# EAGLE design PWM Buck V1 (EAGLE 7.3.0)
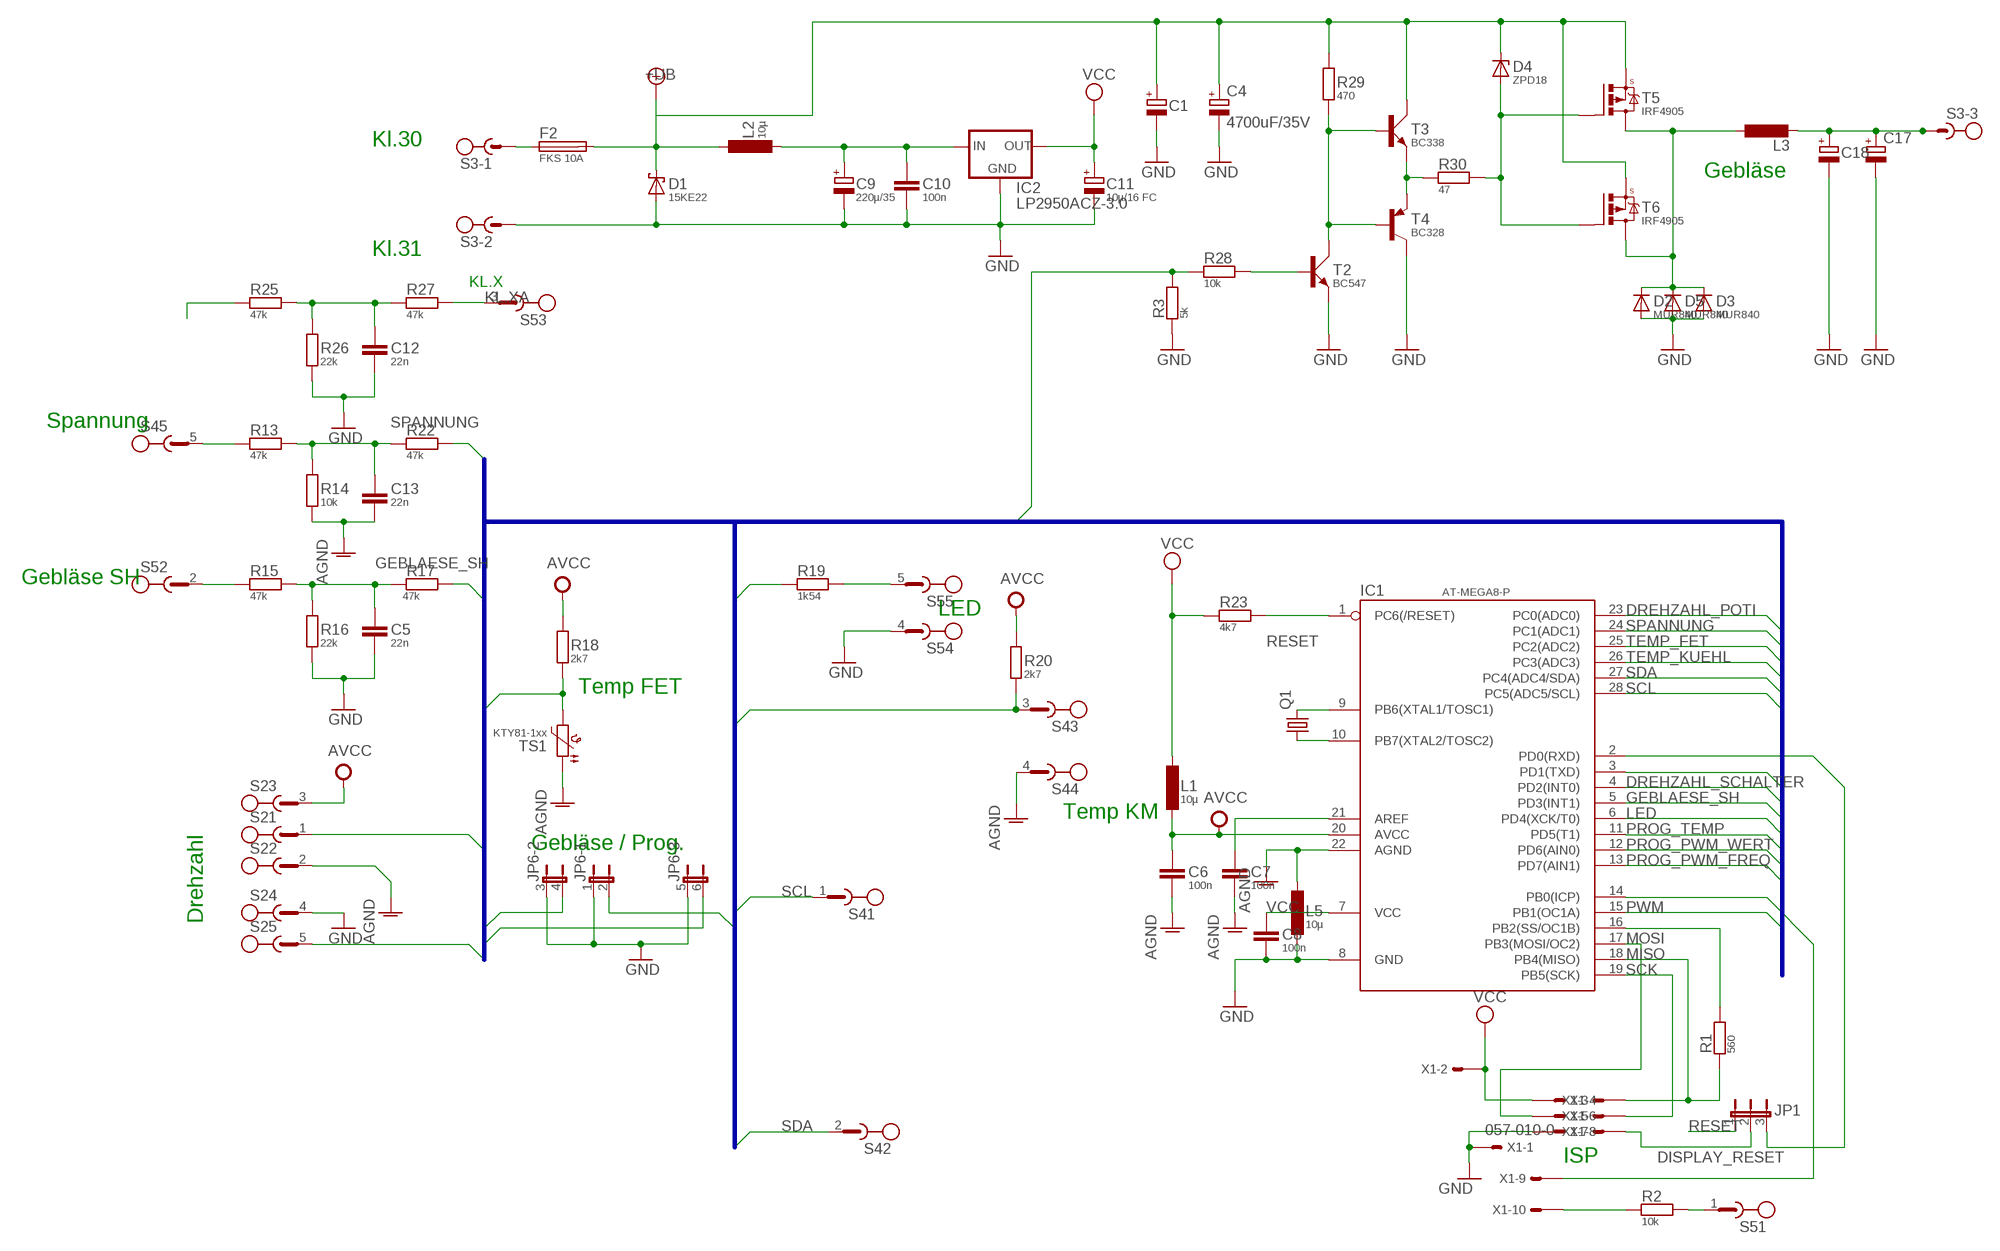
[diagram p0: schematic, sheet 1]

## Parts
C1  C_POL_5-10.5  [E5-10.5]
C4  4700uF/35V  CPOL-EUE7.5-18  [E7,5-18]
C5  22n  C_75_SCHMAL  [C_75_SCHMAL]
C6  100n  C_50_SCHMAL  [C_50_SCHMAL]
C7  100n  C_50_SCHMAL  [C_50_SCHMAL]
C8  100n  C_50_SCHMAL  [C_50_SCHMAL]
C9  220µ/35  C_POL_5-10.5  [E5-10.5]
C10  100n  C_75_SCHMAL  [C_75_SCHMAL]
C11  10µ/16 FC  C_POL_2.5-5  [E2.5-5]
C12  22n  C_75_SCHMAL  [C_75_SCHMAL]
C13  22n  C_75_SCHMAL  [C_75_SCHMAL]
C17  CPOL-EUE5-13  [E5-13]
C18  C_POL_5-10.5  [E5-10.5]
D1  15KE22  15KEXXD  [DO201T15]
D2  MUR840  [TO220ACS]
D3  MUR840  [TO220ACS]
D4  ZPD18  ZPD  [DO35Z10]
D5  MUR840  [TO220ACS]
F2  FKS 10A  FKS  [FKS]
IC1  AT-MEGA8-P  [AT-MEGA8P]
IC2  LP2950ACZ-3.0  [TO92]
JP1  JP2E  [JP2]
JP6  JP3QE  [JP3Q]
L1  10µ  L-2200-12,7  [L-2200-12,7]
L2  10µ  L-2200-12,7  [L-2200-12,7]
L3  L-EU0207/12  [0207/12]
L5  10µ  L-2200-12,7  [L-2200-12,7]
Q1  CRYSTALTC26V  [TC26V]
R1  560  R_10  [R_10]
R2  10k  R_10  [R_10]
R3  5k  R_10  [R_10]
R13  47k  R_10  [R_10]
R14  10k  R_10  [R_10]
R15  47k  R_10  [R_10]
R16  22k  R_10  [R_10]
R17  47k  R_10  [R_10]
R18  2k7  R_10  [R_10]
R19  1k54  R_10  [R_10]
R20  2k7  R_12  [R_12]
R22  47k  R_10  [R_10]
R23  4k7  R_10  [R_10]
R25  47k  R_10  [R_10]
R26  22k  R_10  [R_10]
R27  47k  R_10  [R_10]
R28  10k  R_10  [R_10]
R29  470  R_10  [R_10]
R30  47  R_10  [R_10]
S2  CON-PLATINE_5-POLIG  [CON-PLATINE_5-POLIG]
S3  CON-RIA-220-03  [RIA-220-03]
S4  CON-RIA-183-05  [RIA-183-05]
S5  CON-RIA-183-05  [RIA-183-05]
T2  BC547  BC547-WIDE  [SOT54A-WIDE]
T3  BC338  BC547-WIDE  [SOT54A-WIDE]
T4  BC328  BC557-WIDE  [TO92_WIDE]
T5  IRF4905  MOSFET-P-IRF4905  [TO220BV]
T6  IRF4905  MOSFET-P-IRF4905  [TO220BV]
TS1  KTY81-1xx  PTC-SOD70  [SOD70]
X1  057-010-0  [057-010-0]

## Nets
+UB: C1.+ C4.+ D1.C D4.C F2.2 L2.2 R29.2 T3.C T5.S T6.S
AGND: C6.2 C7.2 C13.1 IC1.22(AGND) L5.2 R14.1 S2.2 S4.4 TS1.1
AVCC: C6.1 IC1.20(AVCC) L1.1 R18.2 R20.2 S2.3
BEL_K58B: R2.2 X1.10
BEL_SH: IC1.14(PB0(ICP)) X1.9
DISPLAY_RESET: JP1.2 X1.7
DREHZAHL_POTI: IC1.23(PC0(ADC0)) S2.1
DREHZAHL_SCHALTER: IC1.4(PD2(INT0)) S2.5
GATE: D4.A R30.1 T5.G T6.G
GEBLAESE_OUT: D2.C D3.C D5.C L3.1 T5.D T6.D
GEBLAESE_SH: IC1.5(PD3(INT1)) R17.1
GND: C1.- C4.- C5.1 C8.2 C9.- C10.2 C11.- C12.1 C17.- C18.- D1.A D2.A D3.A D5.A IC1.8(GND) IC2.2(GND) JP6.1 JP6.3 JP6.5 L5.1 R3.2 R16.1 R26.1 S2.4 S3.2 S5.4 T2.E T4.3(C) X1.1 X1.8
KL.X: IC1.3(PD1(TXD)) R25.1
KL.XA: R27.1 S5.3
LED: IC1.6(PD4(XCK/T0)) R19.2
MISO: IC1.18(PB4(MISO)) R1.1 X1.3
MOSI: IC1.17(PB3(MOSI/OC2)) X1.6
N$1: IC1.9(PB6(XTAL1/TOSC1)) Q1.2
N$2: IC1.10(PB7(XTAL2/TOSC2)) Q1.1
N$3: IC1.16(PB2(SS/OC1B)) R1.2
N$5: F2.1 S3.1
N$6: IC1.2(PD0(RXD)) JP1.3
N$7: C5.2 R15.2 R16.2 R17.2
N$8: C9.+ C10.1 IC2.3(IN) L2.1
N$9: R29.1 T2.C T3.B T4.2(B)
N$11: R2.1 S5.1
N$15: C17.+ C18.+ L3.2 S3.3
N$21: C7.1 IC1.21(AREF)
N$30: R28.1 T2.B
N$31: R30.2 T3.E T4.1(E)
N$33: C12.2 R25.2 R26.2 R27.2
N$36: R19.1 S5.5
NIX: C13.2 R13.2 R14.2 R22.1
PROG_PWM_FREQ: IC1.13(PD7(AIN1)) JP6.6
PROG_PWM_WERT: IC1.12(PD6(AIN0)) JP6.4
PROG_TEMP: IC1.11(PD5(T1)) JP6.2
PWM: IC1.15(PB1(OC1A)) R3.1 R28.2
RESET: IC1.1(PC6(/RESET)) JP1.1 R23.2
SCK: IC1.19(PB5(SCK)) X1.5
SCL: IC1.28(PC5(ADC5/SCL)) S4.1
SDA: IC1.27(PC4(ADC4/SDA)) S4.2
SH: R15.1 S5.2
SPANNUNG: IC1.24(PC1(ADC1)) R22.2
SPG: R13.1 S4.5
TEMP_FET: IC1.25(PC2(ADC2)) R18.1 TS1.2
TEMP_KUEHL: IC1.26(PC3(ADC3)) R20.1 S4.3
VCC: C8.1 C11.+ IC1.7(VCC) IC2.1(OUT) L1.2 R23.1 X1.2 X1.4

## Buses
BUS:STUFE1,STUFE2,STUFE3,A0,CLIMATRONIC,DREHZAHL_POTI,DREHZAHL_SCHALTER,JUMPER_CLIMA,JUMPER_MANUELL,TEMP_FET,TEMP_KUEHL,LED,RELAIS,SPANNUNG,GEBLAESE_SH,INTERFACE1,INTERFACE2,PWM,KL.X,PROG_PWM_FREQ,PROG_TEMP,PROG_PWM_WERT

## Notes on the sheet
- Kl.30
- Gebläse
- Kl.31
- KL.X
- Spannung
- Gebläse SH
- LED
- Temp FET
- Temp KM
- Drehzahl
- Gebläse / Prog.
- ISP

## Library data of the parts
C1 C9 C18 = 0_Eigene:C_POL_5-10.5
C4 C17 = rcl:CPOL-EU: POLARIZED CAPACITOR, European symbol
C5 C10 C12 C13 = 0_Eigene:C_75_SCHMAL
C6-C8 = 0_Eigene:C_50_SCHMAL
C11 = 0_Eigene:C_POL_2.5-5
D1 = 0_Eigene:15KEXXD: DIODE
D2 D3 D5 = 0_Eigene:MUR840: DIODE
D4 = 0_Eigene:ZPD: Z DIODE 500 mW
F2 = 0_Eigene:FKS: Sicherungshalter für KFZ-Flachsicherung
IC1 = 0_Eigene:AT-MEGA8-P
IC2 = v-reg:LP2950?*: Source: http://cache.national.com/ds/LP/LP2950.pdf
JP1 = 0_Eigene:JP2E: JUMPER
JP6 = jumper:JP3QE: JUMPER
L1 L2 L5 = 0_Eigene:L-2200-12,7
L3 = rcl:L-EU: INDUCTOR, European symbol
Q1 = crystal:CRYSTAL: CRYSTAL
R1-R3 R13-R19 R22 R23 R25-R30 = 0_Eigene:R_10
R20 = 0_Eigene:R_12
S2 = 0_Eigene:CON-PLATINE_5-POLIG
S3 = 0_Eigene:CON-RIA-220-03
S4 S5 = 0_Eigene:CON-RIA-183-05
T2 T3 = 0_Eigene:BC547-WIDE
T4 = 0_Eigene:BC557-WIDE
T5 T6 = 0_Eigene:MOSFET-P-IRF4905: P-CHANNEL HEXFET POWER-MOS-FET Source: http://www.irf.com/product-info/datasheets/data/irf9530.pdf
TS1 = 0_Eigene:PTC-: Positive Temperature Coefficient Resistor (PTC) termistor Philips KTY81-210 - KTY81-252 Source: 153627-da-01-en-Temperatur-Sensor_KTY10-6_Philips.pdf
X1 = con-panduit:057-010-: CONNECTOR 10-pin series 057 contact pc board low profile headers

## Board
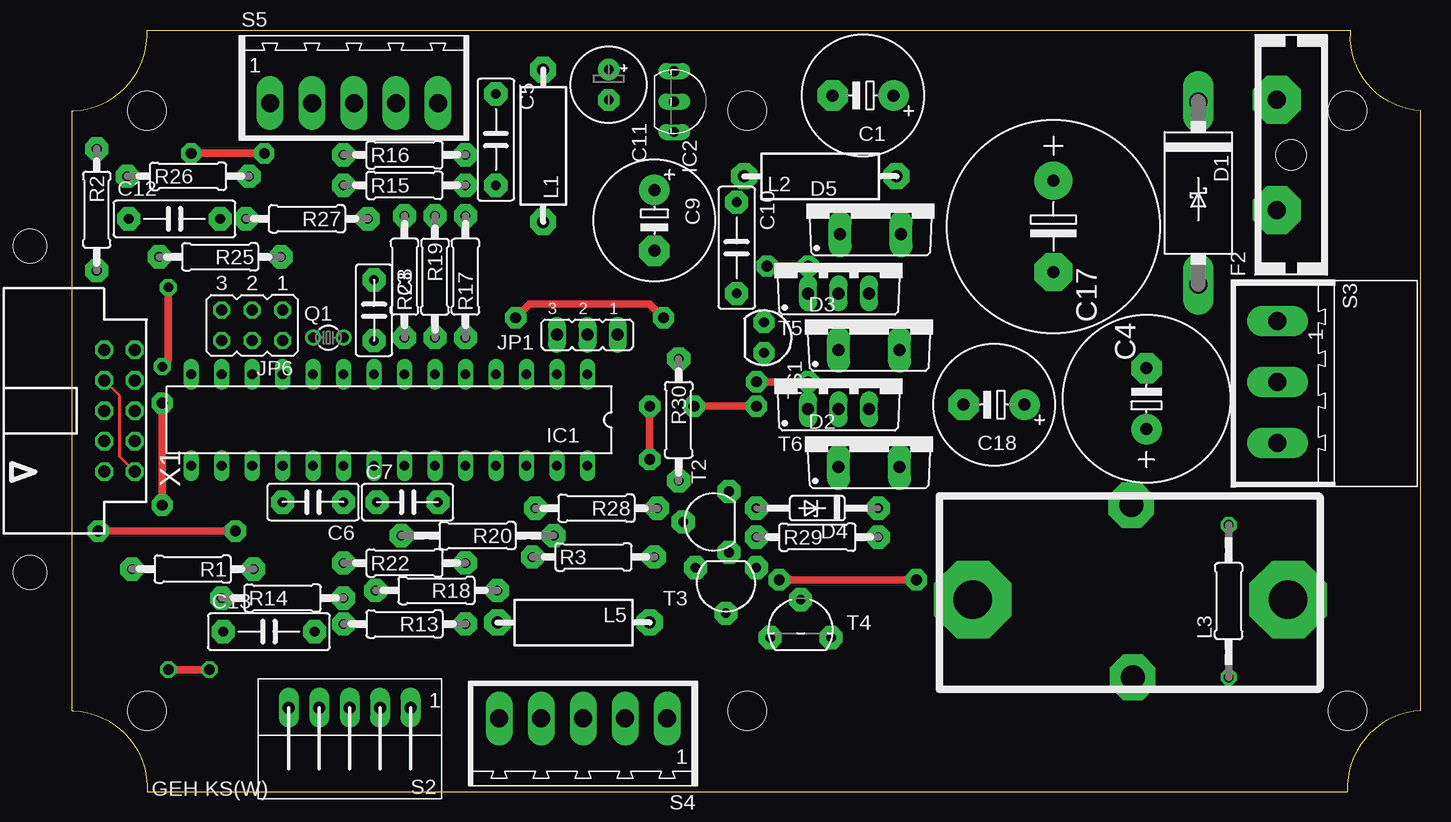
[diagram p1: board, top side]
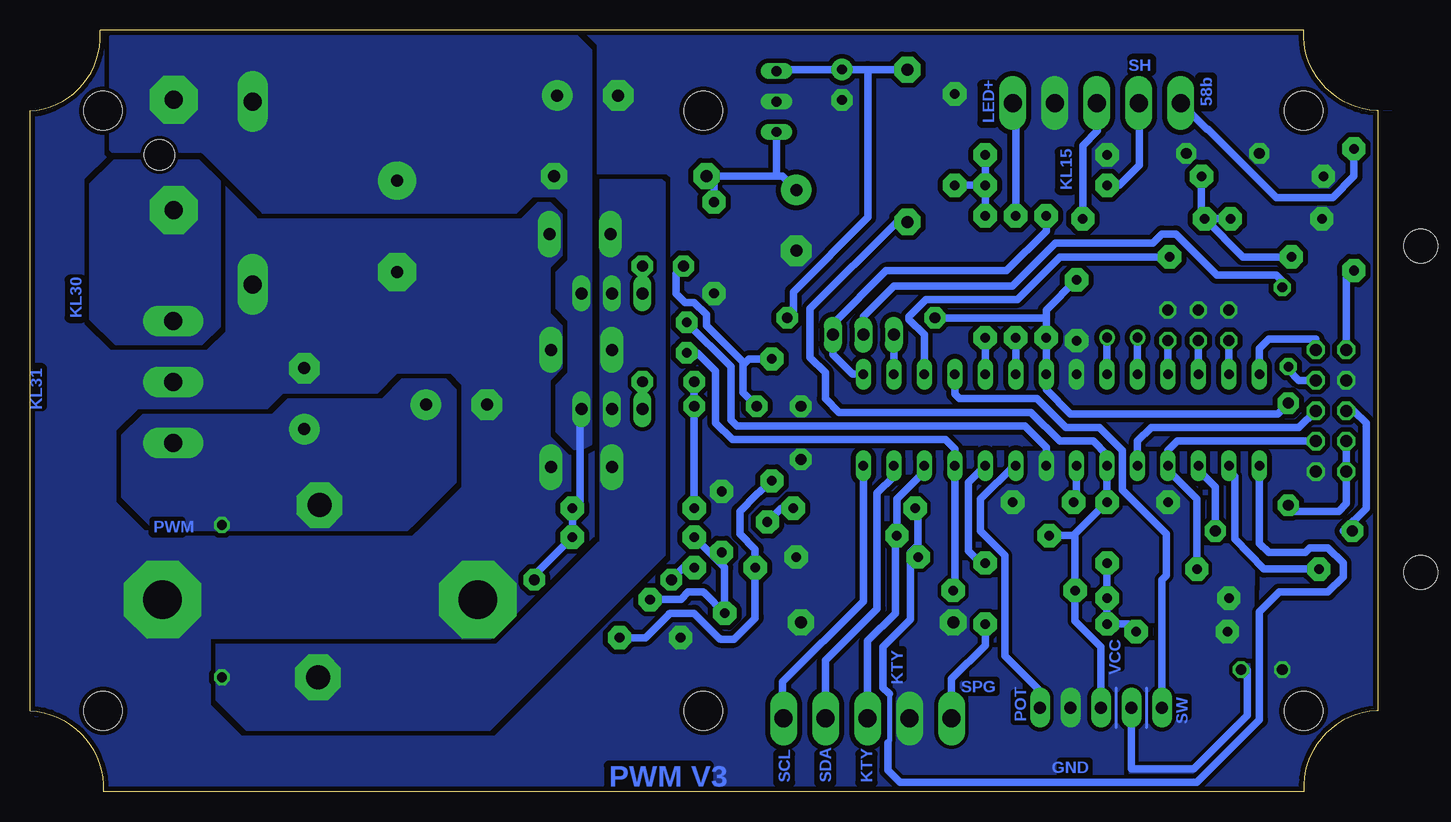
[diagram p2: board, bottom side, seen from below]

Size 112.39 x 63.5 mm. Coordinates in mm from the lower left corner, seen from the top.
Copper layers (1*16): Top 0.035mm / dielectric 1.5mm / Bottom 0.035mm
Design rules "default *": minimum track width 8mil, minimum drill 24mil, track to track 8mil, track to pad 8mil, pad to pad 8mil, via to via 8mil, smd to smd 8mil, copper to edge 12mil, drill to drill 8mil, minimum pad ring 10mil, minimum via ring 8mil, stop-mask expansion 4mil, vias tented up to drill 0mil, thermal gap 10mil

### Footprints (pad centres in the part's own frame; a part is rotated, then mirrored left to right if it is on the bottom)
E5-10.5 = drill 1 pad 2.54: + -2.54,0 | drill 1 pad 2.54 octagon: - 2.54,0
E7,5-18 = drill 1.016 pad 3.15: + -3.81,0 | drill 1.016 pad 3.15 octagon: - 3.81,0
C_75_SCHMAL = drill 0.8 pad 1.93 octagon: 1 -3.81,0; 2 3.81,0
C_50_SCHMAL = drill 0.8 pad 1.93 octagon: 1 -2.54,0; 2 2.54,0
E2.5-5 = drill 0.8 pad 1.778: + -1.27,0 | drill 0.8 pad 1.778 octagon: - 1.27,0
E5-13 = drill 1.016 pad 2.54: + -2.54,0 | drill 1.016 pad 2.54 octagon: - 2.54,0
DO201T15 = drill 1.5 pad 2.54 long: A 7.62,0; C -7.62,0
TO220ACS = drill 1 pad 1.93 long: A 2.54,-2.54; C -2.54,-2.54
DO35Z10 = drill 0.8 pad 1.93 octagon: A 5.08,0; C -5.08,0
FKS = drill 1.5 pad 4 octagon: 1 -4.6,1.2; 2 4.6,1.2 | hole 2.5: 0,0
AT-MEGA8P = drill 0.8 long: 1 -16.51,-3.81; 2 -13.97,-3.81; 3 -11.43,-3.81; 4 -8.89,-3.81; 5 -6.35,-3.81; 6 -3.81,-3.81; 7 -1.27,-3.81; 8 1.27,-3.81; 9 3.81,-3.81; 10 6.35,-3.81; 11 8.89,-3.81; 12 11.43,-3.81; 13 13.97,-3.81; 14 16.51,-3.81; 15 16.51,3.81; 16 13.97,3.81; 17 11.43,3.81; 18 8.89,3.81; 19 6.35,3.81; 20 3.81,3.81; 21 1.27,3.81; 22 -1.27,3.81; 23 -3.81,3.81; 24 -6.35,3.81; 25 -8.89,3.81; 26 -11.43,3.81; 27 -13.97,3.81; 28 -16.51,3.81
TO92 = drill 0.813 long: 1 -2.54,0; 2 0,0; 3 2.54,0
JP2 = drill 1 long: 1 -2.54,0; 2 0,0; 3 2.54,0
JP3Q = drill 0.914 octagon: 1 -2.54,-1.27; 2 -2.54,1.27; 3 0,-1.27; 4 0,1.27; 5 2.54,-1.27; 6 2.54,1.27
L-2200-12,7 = drill 1 pad 2.184 octagon: 1 -6.35,0; 2 6.35,0
0207/12 = drill 0.813 octagon: 1 -6.35,0; 2 6.35,0
TC26V = drill 0.813: 1 -1.27,0; 2 1.27,0
R_10 = drill 0.8 pad 1.93 octagon: 1 -5.08,0; 2 5.08,0
R_12 = drill 0.8 pad 1.93 octagon: 1 -6.35,0; 2 6.35,0
CON-PLATINE_5-POLIG = drill 1 pad 1.676 long: 1 -5.08,0; 2 -2.54,0; 3 0,0; 4 2.54,0; 5 5.08,0
RIA-220-03 = drill 1.5 pad 2.54 long: 1 -7.62,-1.27; 2 -2.54,-1.27; 3 2.54,-1.27
RIA-183-05 = drill 1.5 pad 2.032 long: 1 -5.25,0; 2 -1.75,0; 3 1.75,0; 4 5.25,0; 5 8.75,0
SOT54A-WIDE = drill 0.8 pad 1.93 octagon: B 0,2.54; C -2.54,-1.27; E 2.54,-1.27
TO92_WIDE = drill 0.8 pad 1.93 octagon: 1 2.54,-0.635; 2 0,2.54; 3 -2.54,-0.635
TO220BV = drill 1 long: D 0,-2.54; G -2.54,-2.54; S 2.54,-2.54
SOD70 = drill 0.8 pad 1.778 octagon: 1 -1.27,0; 2 1.27,0
GEH_KSW_120X170 = hole 3.2: 0,0; 50.038,0; 100.076,0; 0,50.038; 50.038,50.038; 100.076,50.038
057-010-0 = drill 1 octagon: 1 -5.08,-5.08; 2 -5.08,-2.54; 3 -2.54,-5.08; 4 -2.54,-2.54; 5 0,-5.08; 6 0,-2.54; 7 2.54,-5.08; 8 2.54,-2.54; 9 5.08,-5.08; 10 5.08,-2.54 | hole 2.8: -13.48,3.66; 13.73,3.66

### Placement (x,y rotation side)
C1  65.91,58.04 180 top
C4  81.79,47.12 270 top
C5  35.31,54.36 270 top
C6  20.07,24.13 180 top
C7  27.94,24.13 0 top
C8  25.15,40.13 270 top
C9  48.51,47.62 270 top
C10  55.37,45.34 270 top
C11  44.7,58.93 270 top
C12  8.51,47.75 0 top
C13  16.38,13.34 0 top
C17  89.53,32.77 90 top
C18  76.83,32.26 180 top
D1  93.85,49.91 270 top
D2  66.42,29.59 0 top
D3  66.42,39.37 0 top
D4  62.1,23.62 180 top
D5  66.55,49.02 0 top
F2  101.6,53.09 90 top
IC1  26.42,30.99 180 top
IC2  50.16,57.53 270 top
JP1  42.93,38.1 180 top
JP6  14.99,38.86 180 top
L1  39.24,53.85 90 top
L2  62.36,51.31 0 top
L3  96.39,15.88 90 top
L5  41.78,14.1 180 top
Q1  21.34,37.85 0 top
R1  10.03,18.54 180 top
R2  2.03,48.51 270 top
R3  43.43,19.56 0 top
R13  27.69,13.97 180 top
R14  17.53,16.13 0 top
R15  27.69,50.55 0 top
R16  27.69,53.09 0 top
R17  32.77,42.93 90 top
R18  30.35,16.76 180 top
R19  30.23,42.93 270 top
R20  33.78,21.34 180 top
R22  27.69,19.05 0 top
R23  27.69,42.93 90 top
R25  12.32,44.58 180 top
R26  9.65,51.31 0 top
R27  19.56,47.75 180 top
R28  43.69,23.62 180 top
R29  62.1,21.21 0 top
R30  50.55,30.99 270 top
S2  23.11,6.99 180 top
S3  101.73,31.62 270 top
S4  44.32,6.1 180 top
S5  21.72,57.4 0 top
T2  53.47,22.48 90 top
T3  54.48,17.4 180 top
T4  60.71,13.46 0 top
T5  63.88,44.07 0 top
T6  63.88,34.42 0 top
TS1  57.66,37.85 270 top
U$1  [GEH_KSW_120X170]  6.22,6.73 0 top
X1  0.13,31.75 90 top

### Tracks (layer width: path | path; a pad name or v marks a point on that pad's centre or on a via)
+UB  (via drill 0.9 pad 1.78)
  Top 0.61: v58.93,17.65 v70.36,17.65
  Bottom 0.61: T6.S 66.55,31.75 66.55,24 66.93,23.62 D4.C R29.2 70.74,17.65 v70.36,17.65 | T3.C 57.91,18.67 v58.93,17.65
  pour Bottom (isolate 0.305, no thermals): 105.54,53.34 105.66,53.47 105.66,62.99 66.8,62.99 65.66,61.85 65.66,28.96 66.42,28.57 67.06,28.57 68.45,29.97 68.45,33.91 67.44,34.92 67.44,39.24 68.45,40.26 68.45,43.31 67.44,44.32 67.44,48.51 68.58,49.66 70.48,49.66 71.88,48.26 92.96,48.26 98.04,53.34
AGND
  Bottom 0.254: 21.84,5.33 21.84,8.64 | 19.3,5.33 19.3,8.64
  Bottom 0.61: TS1.1 53.98,35.43 53.98,30.99 53.47,30.48 29.46,30.48 27.69,28.7 IC1.22
  pour Bottom (isolate 0.305, rank 2, no thermals): 10.54,28.07 41.15,28.19 41.15,1.52 15.62,1.65 15.24,1.65 10.67,6.22
AVCC
  Bottom 0.61: 25.4,21.34 C6.1 IC1.20 22.61,28.07 23.75,29.21 26.54,29.21 28.96,31.62 44.96,31.62 46.1,32.77 46.1,34.92 47.37,36.2 47.37,40.26 40.13,47.5 L1.1 | 25.4,21.34 25.27,21.34 R18.2 25.27,14.22 23.11,12.06 S2.3 | 25.4,21.34 R20.2
BEL_K58B
  Bottom 0.61: X1.10 2.67,42.8 R2.2
BEL_SH
  Bottom 0.61: IC1.14 9.91,36.96 9.14,37.72 5.21,37.72 X1.9
DISPLAY_RESET  (via drill 0.8 pad 1.42)
  Top 0.61: v8,42.04 8,35.94 v7.49,35.43
  Bottom 0.61: JP1.2 42.93,39.62 40.39,42.16 30.48,42.16 26.92,45.72 18.8,45.72 18.03,46.48 16.89,46.48 13.46,43.05 8.51,43.05 8,42.55 v8,42.04 | v7.49,35.43 7.49,35.18 6.6,34.29 X1.7
DREHZAHL_POTI
  Bottom 0.61: IC1.23 30.35,27.18 33.15,24.38 33.15,21.72 31.12,19.68 31.12,11.3 28.19,8.38 S2.1
DREHZAHL_SCHALTER
  Bottom 0.61: IC1.4 35.31,33.15 34.92,32.77 28.45,32.77 26.04,30.35 23.24,30.35 21.34,28.45 21.34,25.15 17.65,21.46 17.65,18.14 arc45 17.73,17.96 18.03,17.65 S2.5
GATE  (via drill 0.9 pad 1.78)
  Top 0.61: v57.91,43.81 v61.34,43.81 | v57.02,34.16 v61.34,34.16 | v51.82,32.13 v57.02,32.13
  Bottom 0.61: v61.34,43.81 T5.G | v61.34,34.16 T6.G | D4.A v57.02,32.13 v57.02,34.16 | v51.82,32.13 52.96,33.27 52.96,35.56 | 52.96,35.56 52.96,35.81 56.01,38.86 56.01,39.75 57.02,40.77 57.79,40.77 58.55,41.53 58.55,43.18 v57.91,43.81 | R30.1 52.45,36.07 52.96,35.56
GEBLAESE_OUT  (via drill 2 pad 3.81)
  other vias: 88.39,9.53
  pour Bottom (isolate 0.305, no thermals): 94.36,5.08 96.9,7.62 96.9,12.32 73.53,12.32 65.02,20.83 64.9,20.83 64.9,51.05 59.69,51.05 59.44,50.8 59.44,19.68 74.04,5.08
GEBLAESE_SH
  Bottom 0.61: IC1.5 R17.1
GND  (via drill 0.9, 0.9 pad 1.68, 0.9 pad 1.78, 3.2 pad 6.45)
  Top 0.254: X1.1 3.94,27.94 3.94,33.02 X1.8
  Top 0.61: v48.13,32.13 v48.13,27.69 | v11.43,10.16 v8,10.16 | v16,53.21 v9.91,53.21
  Bottom 0.61: S2.4 20.57,1.91 15.37,1.91 10.92,6.35 10.92,10.16 v11.43,10.16
  other vias: 75.06,16 101.35,16
  pour Bottom (isolate 0.406, rank 6, no thermals): 0.13,6.73 0.25,6.73 arc-90 6.22,0 106.3,0 arc-90 112.01,6.22 112.01,56.26 arc-90 106.55,63.5 6.22,63.5 arc-90 -1.14,56.77 0.13,56.77
KL.X
  Bottom 0.61: IC1.3 37.85,38.1 39.12,39.37 39.12,39.62 37.72,41.02 30.1,41.02 26.54,44.58 R25.1
KL.XA
  Bottom 0.61: R27.1 24.64,53.85 23.4,55.09 23.4,57.4 S5.3
LED
  Bottom 0.61: IC1.6 R19.2
MISO
  Bottom 0.61: X1.3 16.76,29.21 17.53,28.45 IC1.18 17.4,27.05 17.4,26.67 15.11,24.38 R1.1
MOSI  (via drill 0.9 pad 1.78)
  Top 0.61: v2.16,21.72 v13.59,21.72
  Bottom 0.61: X1.6 2.03,31.75 1.02,30.73 1.02,23.62 2.92,21.72 v2.16,21.72 | v13.59,21.72 13.59,25.4 14.99,26.8 IC1.17
N$1
  Bottom 0.61: IC1.9 Q1.2
N$2
  Bottom 0.61: IC1.10 Q1.1
N$3
  Bottom 0.61: R1.2 9.52,18.54 11.94,21.08 11.94,26.29 12.45,26.8 IC1.16
N$5
  pour Bottom (isolate 0.305, no thermals): 105.28,37.21 98.04,37.21 96.52,38.73 96.52,50.93 98.3,52.7 105.41,52.7 107.44,50.67 107.44,39.37
N$6
  Bottom 0.61: IC1.2 JP1.3
N$7
  Bottom 0.61: R17.2 R15.2 | R15.2 C5.2 | R16.2 R15.2
N$8
  Bottom 0.61: L2.1 55.37,51.31 | 55.37,51.31 50.16,51.31 | 50.16,51.31 49.66,51.31 C9.+ | IC2.3 50.16,51.31 | C10.1 55.37,51.31
N$9
  Bottom 0.61: T4.2 58.27,16 arc-45 58.09,16.08 57.53,16.64 56.37,16.64 arc45 56.19,16.56 T3.B 54.48,18.67 55.37,19.56 | 55.37,19.56 R29.1 | T2.C 54.99,19.94 55.37,19.56
N$11
  Bottom 0.61: R2.1 2.03,51.31 3.81,49.53 8.51,49.53 14.22,55.24 14.31,55.24 S5.1
N$15  (via drill 2 pad 3.81)
  other vias: 88.27,23.88
  pour Bottom (isolate 0.305, no thermals): 91.82,21.72 101.98,21.72 104.78,24.51 104.78,29.72 103,31.5 92.2,31.5 90.93,32.77 83.06,32.77 81.41,34.42 77.72,34.42 76.83,33.53 76.83,25.78 80.26,22.35 80.9,21.72
N$21
  Bottom 0.61: C7.1 25.15,24.38 IC1.21
N$30
  Bottom 0.61: R28.1 49.78,23.62 T2.B
N$31
  Bottom 0.61: T4.1 61.09,12.83 59.13,14.79 arc45 58.95,14.86 57.02,14.86 54.94,12.77 arc-45 54.76,12.7 53.72,12.7 52.02,14.4 arc-45 51.94,14.58 T3.E 51.94,20.19 53.21,21.46 53.21,23.37 51.82,24.77 R30.2
N$33
  Bottom 0.61: R25.2 11.3,44.58 R27.2 | R26.2 14.73,48.01 R27.2 | C12.2 R27.2
N$36
  Bottom 0.61: R19.1 30.23,57.23 30.4,57.4 S5.5
NIX
  Bottom 0.61: R22.1 R14.2 R13.2 20.83,13.97 C13.2
PROG_PWM_FREQ
  Bottom 0.61: IC1.13 JP6.6
PROG_PWM_WERT
  Bottom 0.61: IC1.12 JP6.4
PROG_TEMP
  Bottom 0.61: IC1.11 JP6.2
PWM
  Bottom 0.254: 40.77,4.19 40.89,4.06
  Bottom 0.406: 40.77,8.13 40.77,4.19 | 38.99,19.94 38.35,19.94 R3.1
  Bottom 0.61: R28.2 38.35,23.37 38.35,20.57 38.99,19.94 38.99,14.35 41.27,12.06 41.27,8.64 40.77,8.13 | 40.89,4.06 40.89,1.78 39.88,0.76 15.11,0.76 9.91,5.97 9.91,14.99 8.25,16.64 4.19,16.64 2.92,17.91 2.92,19.05 4.19,20.32 5.71,20.32 6.1,19.94 9.14,19.94 9.91,20.7 IC1.15
RESET
  Bottom 0.61: IC1.1 43.81,34.8 45.47,36.45 JP1.1 45.47,38.99 41.02,43.43 30.99,43.43 27.69,46.74 R23.2
SCK
  Bottom 0.61: IC1.19 20.07,29.21 18.92,30.35 6.6,30.35 X1.5
SCL
  Bottom 0.61: IC1.28 42.93,15.88 49.66,9.14 49.66,6.18 S4.1
SDA
  Bottom 0.61: S4.2 46.07,10.95 41.78,15.24 41.78,24.89 40.39,26.29 IC1.27
SH
  Bottom 0.61: R15.1 21.59,50.55 19.9,52.24 19.9,57.4 S5.2
SPANNUNG
  Bottom 0.61: R22.2 33.15,19.05 34.16,20.07 34.16,25.78 IC1.24
SPG
  Bottom 0.61: S4.5 35.57,9.38 32.77,12.19 R13.1
TEMP_FET
  Bottom 0.61: TS1.2 56.77,36.58 55.24,35.05 55.24,30.73 53.85,29.34 36.07,29.34 35.31,28.57 IC1.25 35.31,16.76 R18.1
TEMP_KUEHL
  Bottom 0.61: S4.3 42.57,12.54 40.26,14.86 40.26,21.34 R20.1 40.13,24.26 40.13,24.38 37.92,26.6 arc-45 37.85,26.77 IC1.26 37.97,27.05
VCC  (via drill 0.9 pad 1.78)
  Top 0.61: v36.96,39.5 38.1,40.64 48.13,40.64 v49.28,39.5 | v7.49,23.88 v7.49,32.38
  Bottom 0.406: IC2.1 50.16,60.2
  Bottom 0.61: 50.29,60.2 50.16,60.2 C11.+ 42.55,60.2 | 42.55,60.2 L1.2 | 27.69,39.5 R23.1 IC1.7 27.69,33.53 25.65,31.5 8.38,31.5 v7.49,32.38 | 27.69,39.5 v36.96,39.5 | v49.28,39.5 48.77,39.5 48.77,41.66 42.55,47.88 42.55,60.2 | C8.1 27.69,40.13 27.69,39.5 | v7.49,23.88 6.98,23.37 3.3,23.37 2.67,24 X1.2 X1.4

### Text on the board
Bottom: SH | 58b | LED+ | KL15 | KL30 | KL31 | PWM | VCC | KTY | SPG | SW | POT | GND | KTY | SDA | SCL | PWM V3